# Altium project Slave.PrjPcb
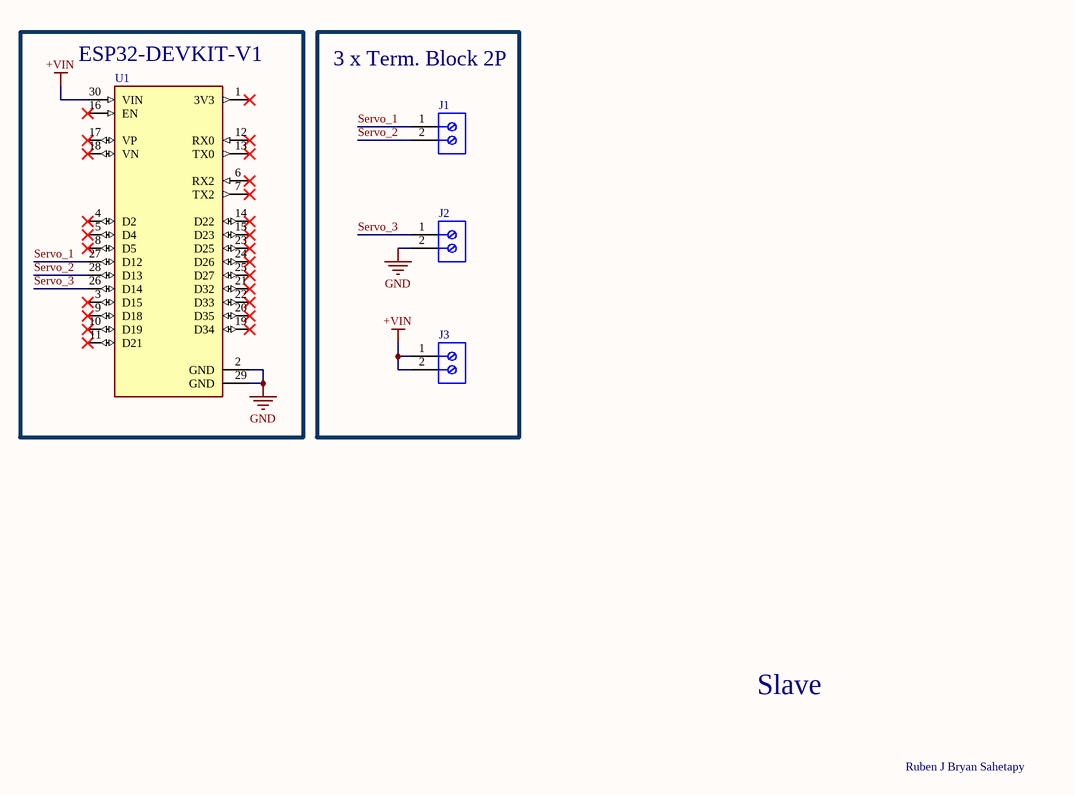
[diagram p0: SCH_Slave.SchDoc]
1 sheet, 4 parts. Net scope: global (net labels, ports and power ports of the same name join across sheets).

## Sheet SCH_Slave.SchDoc
size A4; SheetNumber: 1; SheetTotal: 1

### Parts
J1  Term. Block 2P  [691253410002]  (value not drawn)
J2  Term. Block 2P  [691253410002]  (value not drawn)
J3  3 x Term. Block 2P  [691253410002]
U1  ESP32-DEVKIT-V1  [MODULE_ESP32_DEVKIT_V1]

### Nets
+VIN: J3.1 J3.2 U1.30(VIN)
GND: J2.2 U1.2(GND) U1.29(GND)
Servo_1: J1.1 U1.27(D12)
Servo_2: J1.2 U1.28(D13)
Servo_3: J2.1 U1.26(D14)

Not connected (* = marked no-connect by the designer): U1 1(3V3)* 3(D15)* 4(D2)* 5(D4)* 6(RX2)* 7(TX2)* 8(D5)* 9(D18)* 10(D19)* 11(D21)* 12(RX0)* 13(TX0)* 14(D22)* 15(D23)* 16(EN)* 17(VP)* 18(VN)* 19(D34)* 20(D35)* 21(D32)* 22(D33)* 23(D25)* 24(D26)* 25(D27)*

### Notes on the sheet
- Slave
- Ruben J Bryan Sahetapy

### Library data of the parts
J1-J3 = CMP-1502-02746-3: Terminal Block, 7.62MM Pitch, Horizontal, Rising Cage Clamp, 12-30 AWG, 2 Pin
U1 = ESP32-DEVKIT-V1: ESP32-DEVKIT-V1 30 Pins; Value: Dual Core, Wi-Fi, BLE; MF: Do it; SnapEDA_Link: https://www.snapeda.com/parts/ESP32-DEVKIT-V1/Do+it/view-part/?ref=snap; Package: None; MP: ESP32-DEVKIT-V1; Check_prices: https://www.snapeda.com/parts/ESP32-DEVKIT-V1/Do+it/view-part/?ref=eda; Part Number: ESP32-DEVKIT-V1; PartID: ESP32-DEVKIT-V1; TempMin: -40; TempMax: 85; Link: https://www.snapeda.com/parts/ESP32-DEVKIT-V1/Do+it/view-part/?ref=eda